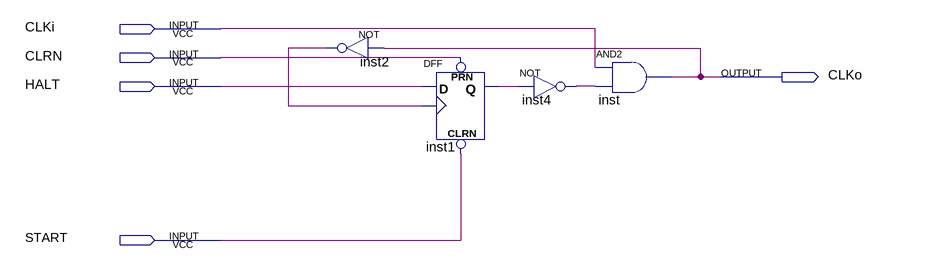
[diagram p0: schematic sheet]
// Quartus schematic ks.bdf as structural Verilog: 4 symbols, 5 pins
module ks (
  input  CLKi,
  input  CLRN,
  input  HALT,
  input  START,
  output CLKo
);

  wire inst1_q, inst2_out, inst4_out;

  not inst2 (inst2_out, CLKo);
  DFF inst1 (.CLRN(START), .CLK(inst2_out), .D(HALT), .PRN(CLRN), .Q(inst1_q));
  not inst4 (inst4_out, inst1_q);
  and inst (CLKo, CLKi, inst4_out);
endmodule
